# Altium schematic sheet Esquema.SchDoc
size A3; SheetNumber: 2; SheetTotal: 2
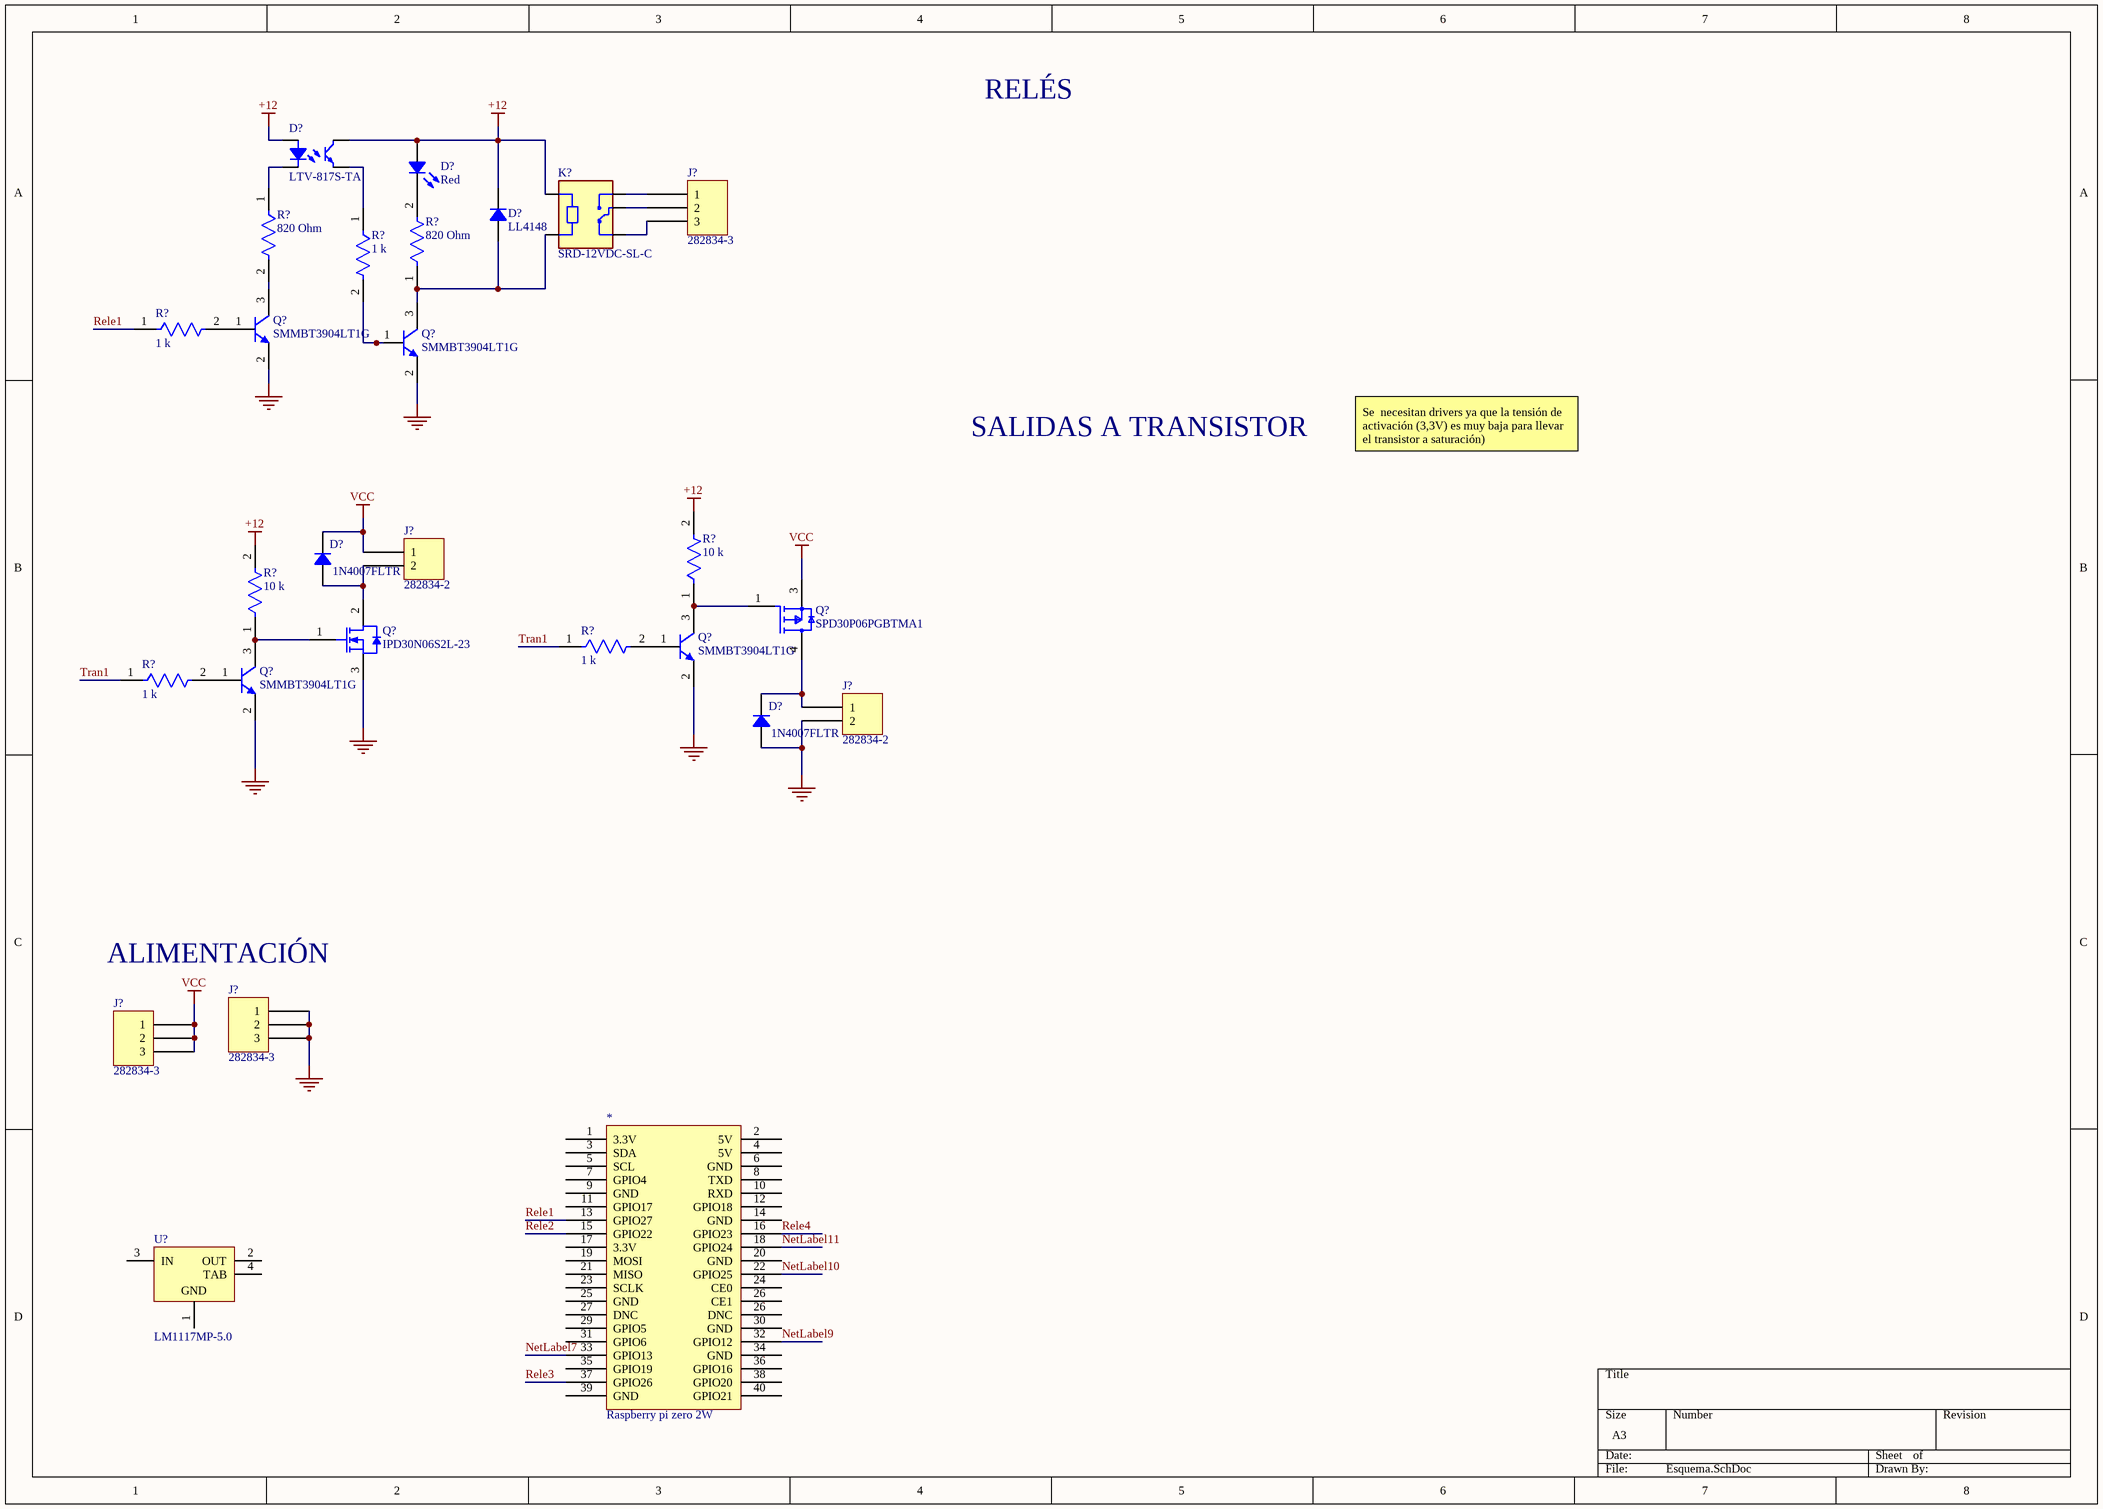
[diagram p0: Esquema.SchDoc]

## Parts
(Parts that share a designator on the sheet are numbered #1, #2 ... from top to bottom, then left to right.)
*  Raspberry pi zero 2W  [PCBComponent_1]
D?#1  LTV-817S-TA  [LITEON LTV-817]
D?#2  Red  [LED 1206_3216 RED]
D?#3  LL4148  [SOD-80 MiniMELF]
D?#4  1N4007FLTR  [SOD123F]
D?#5  1N4007FLTR  [SOD123F]
J?#1  282834-3  [TE 282834-3]
J?#2  282834-2  [TE 282834-2]
J?#3  282834-2  [TE 282834-2]
J?#4  282834-3  [TE 282834-3]
J?#5  282834-3  [TE 282834-3]
K?  SRD-12VDC-SL-C  [RELAY_SRD-05VDC-SL-C]
Q?#1  SMMBT3904LT1G  [ONSC-SOT-23-3-318-08_V]
Q?#2  SMMBT3904LT1G  [ONSC-SOT-23-3-318-08_V]
Q?#3  SPD30P06PGBTMA1  [FP-PG-TO252-3-MFG]
Q?#4  IPD30N06S2L-23  [INF-PG-TO252-3-11_L]
Q?#5  SMMBT3904LT1G  [ONSC-SOT-23-3-318-08_V]
Q?#6  SMMBT3904LT1G  [ONSC-SOT-23-3-318-08_V]
R?#1  820 Ohm  [FP-CRCW0603-HPe3-MFG]
R?#2  1 k  [FP-MCT0603-IPC_C]
R?#3  820 Ohm  [FP-CRCW0603-HPe3-MFG]
R?#4  1 k  [FP-MCT0603-IPC_C]
R?#5  10 k  [FP-CRCW0603-HPe3-MFG]
R?#6  10 k  [FP-CRCW0603-HPe3-MFG]
R?#7  1 k  [FP-MCT0603-IPC_C]
R?#8  1 k  [FP-MCT0603-IPC_C]
U?  LM1117MP-5.0  [MP04A_N]

## Nets
+12: D?#1.1 D?#1.4 D?#2.1 D?#3.2 K?.A1 R?#5.2 R?#6.2
GND: D?#5.1 J?#3.2 J?#4.1 J?#4.2 J?#4.3 Q?#1.2(E) Q?#2.2(E) Q?#4.3(SOURCE) Q?#5.2(E) Q?#6.2(E)
VCC: D?#4.2 J?#2.1 J?#5.1 J?#5.2 J?#5.3 Q?#3.3(S)
NetLabel7: *.33(GPIO13)
NetLabel9: *.32(GPIO12)
NetLabel10: *.22(GPIO25)
NetLabel11: *.18(GPIO24)
Rele1: *.13(GPIO27) R?#4.1
Rele2: *.15(GPIO22)
Rele3: *.37(GPIO26)
Rele4: *.16(GPIO23)
Tran1: R?#7.1 R?#8.1
NetD?#1_2: D?#1.2 R?#1.1
NetD?#1_3: D?#1.3 R?#2.1
NetD?#2_2: D?#2.2 R?#3.2
NetD?#3_1: D?#3.1 K?.A2 Q?#2.3(C) R?#3.1
NetD?#4_1: D?#4.1 J?#2.2 Q?#4.2(DRAIN)
NetD?#5_2: D?#5.2 J?#3.1 Q?#3.4(D)
NetJ?#1_1: J?#1.1 K?.NO
NetJ?#1_2: J?#1.2 K?.COM
NetJ?#1_3: J?#1.3 K?.NC
NetQ?#1_1: Q?#1.1(B) R?#4.2
NetQ?#1_3: Q?#1.3(C) R?#1.2
NetQ?#2_1: Q?#2.1(B) R?#2.2
NetQ?#3_1: Q?#3.1(G) Q?#5.3(C) R?#5.1
NetQ?#4_1: Q?#4.1(GATE) Q?#6.3(C) R?#6.1
NetQ?#5_1: Q?#5.1(B) R?#7.2
NetQ?#6_1: Q?#6.1(B) R?#8.2

Not connected (* = marked no-connect by the designer): * 1(3.3V) 2(5V) 3(SDA) 4(5V) 5(SCL) 6(GND) 7(GPIO4) 8(TXD) 9(GND) 10(RXD) 11(GPIO17) 12(GPIO18) 14(GND) 17(3.3V) 19(MOSI) 20(GND) 21(MISO) 23(SCLK) 24(CE0) 25(GND) 26(CE1) 27(DNC) 29(GPIO5) 30(GND) 31(GPIO6) 34(GND) 35(GPIO19) 36(GPIO16) 38(GPIO20) 39(GND) 40(GPIO21); U? 1(GND) 2(OUT) 3(IN) 4(TAB)

## Notes on the sheet
- RELÉS
- SALIDAS A TRANSISTOR
- Se  necesitan drivers ya que la tensión de activación (3,3V) es muy baja para llevar el transistor a saturación)
- (near J?#4) ALIMENTACIÓN

## Library data of the parts
D?#1 = LTV-817S-TA: OPTOISOLATR 5KV TRANSISTOR 4-SMD; Manufacturer: Lite-On Inc.; Current - DC Forward (If) (Max): 50mA; Current Transfer Ratio (Max): 600% @ 5mA; Current Transfer Ratio (Min): 50% @ 5mA; Input Type: DC; Number of Channels: 1; Rise / Fall Time (Typ): 4µs, 3µs; Vce Saturation (Max): 200mV; Voltage - Forward (Vf) (Typ): 1.2V; Voltage - Isolation: 5000Vrms; Voltage - Output (Max): 35V; Part Number: LTV-817S-TA; ComponentLink1Description: Datasheet; ComponentLink1URL: http://optoelectronics.liteon.com/upload/download/DS-70-96-0016/LTV-8X7%20series%20201610%20.pdf; ComponentLink2Description: DigiKey Link; ComponentLink2URL: http://digikey.com/product-detail/en/lite-on-inc/LTV-817S-TA/160-2038-1-ND/3711420; Current - Output / Channel: 50mA; Device Package: 4-SMD, Gull Wing; LastUpdated: 12/01/2020 21:59:02; Lifecycle Status: Active; Minimum Order: 1; Mounting Type: Surface Mount; Operating Temperature: -30°C ~ 110°C; Output Type: Transistor; Package / Case: 4-SMD, Gull Wing; Packaging: TapeAndReel; Part Status: Active; Price: 0.12; Series: -; Supplier 1: DigiKey; Supplier Part Number 1: 160-2038-1-ND; Supplier Device Package: 4-SMD
D?#2 = LTST-C150KAKT: LED RED CLEAR SMD; Manufacturer: Lite-On Inc.; Configuration: Standard; Current - Test: 20mA; Lens Color: Colorless; Lens Size: 2.06mm x 1.60mm; Lens Style: Rectangle with Flat Top; Millicandela Rating: 55mcd; Viewing Angle: 130°; Voltage - Forward (Vf) (Typ): 2V; Wavelength - Dominant: 615nm; Wavelength - Peak: 621nm; Part Number: LTST-C150KAKT; Color: Red; ComponentLink1Description: Datasheet; ComponentLink1URL: //media.digikey.com/pdf/Data%20Sheets/Lite-On%20PDFs/LTST-C150KAKT.pdf; ComponentLink2Description: DigiKey Link; ComponentLink2URL: http://digikey.com/product-detail/en/lite-on-inc/LTST-C150KAKT/160-1402-1-ND/386755; Device Package: 1206 (3216 Metric); Height (Max): 1.10mm; LastUpdated: 03/06/2024 20:00:41; Lens Transparency: Clear; Lifecycle Status: Active; Minimum Order: 1; Mounting Type: Surface Mount; Package / Case: 1206 (3216 Metric); Packaging: TapeAndReel; PartId: 189; Part Status: Active; Price: 0.07; Series: -; Size / Dimension: 3.20mm L x 1.60mm W; Supplier 1: DigiKey; Supplier Part Number 1: 160-1402-1-ND; Value: Red
D?#3 = LL4148: DIODE GEN PURP 100V 200MA SOD80; Manufacturer: ON Semiconductor; Current - Reverse Leakage @ Vr: 25nA @ 20V; Diode Type: Standard; Reverse Recovery Time (trr): 4ns; Speed: Small Signal =< 200mA (Io), Any Speed; Voltage - Forward (Vf) (Max) @ If: 1V @ 10mA; Part Number: LL4148; ComponentLink1Description: Datasheet; ComponentLink1URL: https://www.onsemi.com/pub/Collateral/LL4148-D.pdf; ComponentLink2Description: DigiKey Link; ComponentLink2URL: http://digikey.com/product-detail/en/on-semiconductor/LL4148/LL4148FSCT-ND/1923118; Current - Average Rectified (Io): 200mA; LastUpdated: 03/06/2024 20:05:39; Lifecycle Status: Active; Minimum Order: 1; Mounting Type: Surface Mount; Operating Temperature - Junction: -55°C ~ 175°C; Package / Case: DO-213AC, MINI-MELF, SOD-80; Packaging: TapeAndReel; PartId: 2621; Part Status: Active; Price: 0.02; Series: -; Supplier 1: DigiKey; Supplier Part Number 1: LL4148FSCT-ND; Supplier Device Package: SOD-80; Voltage - DC Reverse (Vr) (Max): 100V
D?#4 D?#5 = 1N4007FLTR: STANDARD RECTIFIER 1000V SOD-123; Manufacturer: SMC Diode Solutions; Capacitance @ Vr, F: 15pF @ 4V, 1MHz; Current - Average Rectified (Io): 1A; Current - Reverse Leakage @ Vr: 5µA @ 1000V; Speed: Standard Recovery >500ns, > 200mA (Io); Voltage - Forward (Vf) (Max) @ If: 1.1V @ 1A; Part Number: 1N4007FLTR; ComponentLink1Description: Datasheet; ComponentLink1URL: http://www.smc-diodes.com/propdf/1N4001FL-1N4007FL%20N1646%20REV.A.pdf; ComponentLink2Description: DigiKey Link; ComponentLink2URL: http://digikey.com/product-detail/en/smc-diode-solutions/1N4007FLTR/1655-1N4007FLCT-ND/11657827; Diode Type: Standard; LastUpdated: 30/08/2020 20:59:55; Lifecycle Status: Active; Minimum Order: 1; Mounting Type: Surface Mount; Package / Case: SOD-123F; Packaging: TapeAndReel; PartId: 3314; Price: 0.01; Supplier 1: DigiKey; Supplier Part Number 1: 1655-1N4007FLCT-ND; Supplier Device Package: SOD-123FL; Voltage - DC Reverse (Vr) (Max): 1000V
J?#1 J?#4 J?#5 = 282834-3: TERM BLK 3P SIDE ENT 2.54MM PCB; Manufacturer: TE Connectivity AMP Connectors; Current: 10A; Mating Orientation: Horizontal with Board; Number of Levels: 1; Pitch: 0.100" (2.54mm); Positions Per Level: 3; Voltage: 150V; Wire Gauge: 16-30 AWG; Wire Termination: Screw - Rising Cage Clamp; Part Number: 282834-3; Color: Green; ComponentLink1Description: Datasheet; ComponentLink1URL: https://www.te.com/commerce/DocumentDelivery/DDEController?Action=srchrtrv&DocNm=282834&DocType=Customer+Drawing&DocLang=English; ComponentLink2Description: DigiKey Link; ComponentLink2URL: http://digikey.com/product-detail/en/te-connectivity-amp-connectors/282834-3/A98334-ND/1153264; LastUpdated: 15/01/2020 4:15:50; Lifecycle Status: Active; Minimum Order: 1; Mounting Type: Through Hole; Packaging: Bulk; Part Status: Active; Price: 2.01; Series: Buchanan; Supplier 1: DigiKey; Supplier Part Number 1: A98334-ND
J?#2 J?#3 = 282834-2: TERM BLK 2P SIDE ENT 2.54MM PCB; Manufacturer: TE Connectivity AMP Connectors; Current: 10A; Mating Orientation: Horizontal with Board; Number of Levels: 1; Pitch: 0.100" (2.54mm); Positions Per Level: 2; Voltage: 150V; Wire Gauge: 16-30 AWG; Wire Termination: Screw - Rising Cage Clamp; Part Number: 282834-2; Color: Green; ComponentLink1Description: Datasheet; ComponentLink1URL: https://www.te.com/commerce/DocumentDelivery/DDEController?Action=srchrtrv&DocNm=282834&DocType=Customer+Drawing&DocLang=English; ComponentLink2Description: DigiKey Link; ComponentLink2URL: http://digikey.com/product-detail/en/te-connectivity-amp-connectors/282834-2/A98333-ND/1150135; LastUpdated: 15/01/2020 4:15:38; Lifecycle Status: Active; Minimum Order: 1; Mounting Type: Through Hole; Packaging: Bulk; Part Status: Active; Price: 0.88; Series: Buchanan; Supplier 1: DigiKey; Supplier Part Number 1: A98333-ND
K? = SRD-05VDC-SL-C: 5V Trigger Relay Module For Arduino And Raspberry Pi 5V Trigger Relay Module For Arduino And Raspberry Pi; MF: Songle Relay; Check_prices: https://www.snapeda.com/parts/SRD-05VDC-SL-C/Songle+Relay/view-part/?ref=eda; Value: *; Availability: Not in stock; Price: None; Package: NON STANDARD-5 Songle Relay; MP: SRD-05VDC-SL-C; SnapEDA_Link: https://www.snapeda.com/parts/SRD-05VDC-SL-C/Songle+Relay/view-part/?ref=snap
Q?#1 Q?#2 Q?#5 Q?#6 = CMP-1048-00625-1: General Purpose Transistor, NPN Silicon, 3-Pin SOT-23, Pb-Free, Tape and Reel; Manufacturer: On Semiconductor; IC Continuous (A): 0.2; fT Min (MHz): 300; PackageDescription: 3-Pin Small Outline Transistor, Body 2.92 x 1.3 mm, Pitch 0.95 mm; Mounting Technology: Surface Mount; ComponentLink1Description: Manufacturer URL; DatasheetVersion: Rev. 12; PackageReference: SOT-23-3-318-08; ComponentLink1URL: http://www.onsemi.com/; ComponentLink3Description: Package Specification; RoHS: TRUE; PartNumber: SMMBT3904LT1G; Polarity: NPN; Packing: Tape and Reel; ComponentLink2URL: http://www.onsemi.cn/pub_link/Collateral/MMBT3904LT1-D.PDF; PackageVersion: Rev. AP, 11/2009; ComponentLink2Description: Datasheet; ComponentLink3URL: http://www.onsemi.cn/pub_link/Collateral/318-08.PDF
Q?#3 = CMP-00196-21387583-1: SPD30P06PGBTMA1 Transistor, MOSFET, P-channel, -60V, 0.075 Ohm, -30A, TO252-3, SIPMOS Power; Drain to Source Resistance: 69mΩ; Max Junction Temperature (Tj): 175°C; Power Dissipation: 125W; Rise Time: 11ns; Number of Elements: 1; On-State Resistance: 75mΩ; Turn-Off Delay Time: 30ns; Input Capacitance: 1.228nF; Turn-On Delay Time: 13ns; Gate to Source Voltage (Vgs): 20V; Fall Time: 20ns; Mount: Surface Mount; Number of Pins: 3; Package Quantity: 2500; Halogen Free: Not Halogen Free; Number of Channels: 1; Packaging: Tape & Reel; Height: 2.5mm; Schedule B: 8541290080, 8541290080; Continuous Drain Current (ID): -30A; Max Operating Temperature: 175°C; NexarPartId: 21387583; RoHS: Compliant; Drain to Source Voltage (Vdss): -60V; Drain to Source Breakdown Voltage: -60V; Min Operating Temperature: -55°C; Lead Free: Contains Lead; Max Dual Supply Voltage: -60V; Case/Package: TO-252; Lifecycle Status: Production
Q?#4 = CMP-1138-00121-1: OptiMOS Power-Transistor, 55 V VDS, 30 A ID, PG-TO252-3-11, Reel, Green; Manufacturer: Infineon; QG: 33 nC; RthJC (max): 1.5 K/W; VGS(th) (min): 1.2 V; IDpuls (max): 120 A; RDS (on) (max) (@10V): 23 mOhm; ID (max): 30 A; VDS (max): 55 V; VGS(th) (max): 2 V; Ptot (max): 100 W; Green: TRUE; RDS (on) (max) (@4.5V): 30.0 mOhm; Mounting Technology: Surface Mount; PartNumber: IPD30N06S2L-23; ComponentLink3URL: http://www.infineon.com/dgdl/BTS142_DS_13.pdf?folderId=db3a3043163797a6011667aa084c0e01&fileId=db3a3043163797a6011667ac98be0e02&location=en.Products.Automotive_ICs.Smart_High-_and_Low-Side_Switches.HITFET___TEMPFET__-_Smart_Low-Side_Switches.DATASHEET.BTS1; ComponentLink2Description: Datasheet; ComponentLink1Description: Manufacturer URL; Packing: Reel; DatasheetVersion: Rev. 1.0; PackageDescription: 3-Pin Plastic (Green) Transistor Single Outline Package, 6.5 x 6.12 mm Body, 2.28 mm Pitch; ComponentLink3Description: Package Specification; ComponentLink2URL: http://www.infineon.com/dgdl/IPD30N06S2L-23_green.pdf?folderId=db3a304412b407950112b4322c6d574b&fileId=db3a304412b407950112b433bafe5d69&location=en.Products.Automotive_ICs.Automotive_MOSFETs.Single__N-Channel_55V_MOSFETs.DATASHEET.IPD30N06S2L-23_green.pdf; Halogen-free: TRUE; PackageVersion: Dec-06; PackageReference: PG-TO252-3-11; Technology: OptiMOS; ComponentLink1URL: http://www.infineon.com/
R?#1 R?#3 = CMP-02407-003128-1: RES Thick Film, 820Ω, 1%, 0.33W, 100ppm/°C, 0603; Voltage Rating: 75V; Max Power Dissipation: 250mW; Resistance: 820R; Temperature Coefficient: 100ppm/°C; Termination: SMD/SMT; Military Standard: Not; Features: Automotive AEC-Q200; Composition: Thick Film; Voltage Rating (DC): 75V; Contact Plating: Tin; Package Quantity: 1; Case Code (Metric): 1608; Width: 0.033inch; Case/Package: 0603; Packaging: Tape and Reel; Depth: 0.85mm; Lead Free: Lead Free; Tolerance: 1%; Length: 1.6mm; Power Rating: 250mW; Weight: 7.1E-05oz; Case Code (Imperial): 0603; Radiation Hardening: No; Number of Terminations: 2; Max Operating Temperature: 155°C; Height: 0.45mm; Min Operating Temperature: -55°C
R?#2 R?#4 R?#7 R?#8 = CMP-02407-000265-1: MCT0603PD1001DP500 RES SMD 100 OHM 1% 1/8W 0603; Resistance: 1kR; Temperature Coefficient: 25ppm/°C; Tolerance: 0.5%; Max Power Dissipation: 250mW; Case Code (Metric): 1608; Case Code (Imperial): 0603; Number of Terminations: 2; Case/Package: 0603; Features: Automotive AEC-Q200; Max Operating Temperature: 175°C; Min Operating Temperature: -55°C; Composition: Thin Film; Packaging: Tape and Reel
R?#5 R?#6 = CMP-2000-03835-2: CRCW060310K0FKEAHP RES SMD 10K OHM 1% 1/3W 0603; Resistance: 10kR; Voltage Rating (DC): 75V; Max Power Dissipation: 250mW; Temperature Coefficient: 100ppm/°C; Case Code (Metric): 1608; Features: Automotive AEC-Q200; Termination: SMD/SMT; Number of Terminations: 2; Case Code (Imperial): 0603; Tolerance: 1%; Depth: 0.85mm; Package Quantity: 10; Length: 1.6mm; Packaging: Tape and Reel; Contact Plating: Tin; Radiation Hardening: No; Case/Package: 0603; Composition: Thick Film; Voltage Rating: 75V; Weight: 7.1E-05oz; Max Operating Temperature: 155°C; Lead Free: Lead Free; Width: 0.033inch; Power Rating: 250mW; Min Operating Temperature: -55°C; Military Standard: Not; Height: 0.45mm
U? = CMP-0062-01640-3: 800mA Low-Dropout Linear Regulator, 4-pin SOT-223; Manufacturer: National Semiconductor; CompType: LDO IC; PackageTopMarking: XYTT*N06A; High-Reliability: Y; PowerWise: N; Code_IPC: SOT223-4; PackageVersion: revB, Apr-2003; RoHS: N; Code_JEDEC: TO-261-AA; PinCount: 4; ComponentLink1URL: http://www.national.com/; ComponentLink4URL: http://www.national.com/packaging/folders/mp04a.html; RevisionNote: SCH symbol layout adjusted; PackageDescription: Molded SOT-223, 6.50 x 3.56 x 1.6mm Body, 4 Lead, 2.3mm Pitch; DatasheetVersion: Apr-2006; ComponentLink3URL: http://www.national.com/pf/LM/LM1117.html; ComponentLink2URL: http://www.national.com/ds/LM/LM1117.pdf; PartNumber: LM1117MP-5.0; ComponentLink2Description: LM1117 Datasheet; ComponentLink3Description: LM1117 Web Page; ComponentLink4Description: MP04A Package Page; PackageReference: MP04A; ComponentLink1Description: Manufacturer URL